# EAGLE design led_analog_clock_v1 (EAGLE 5.07)
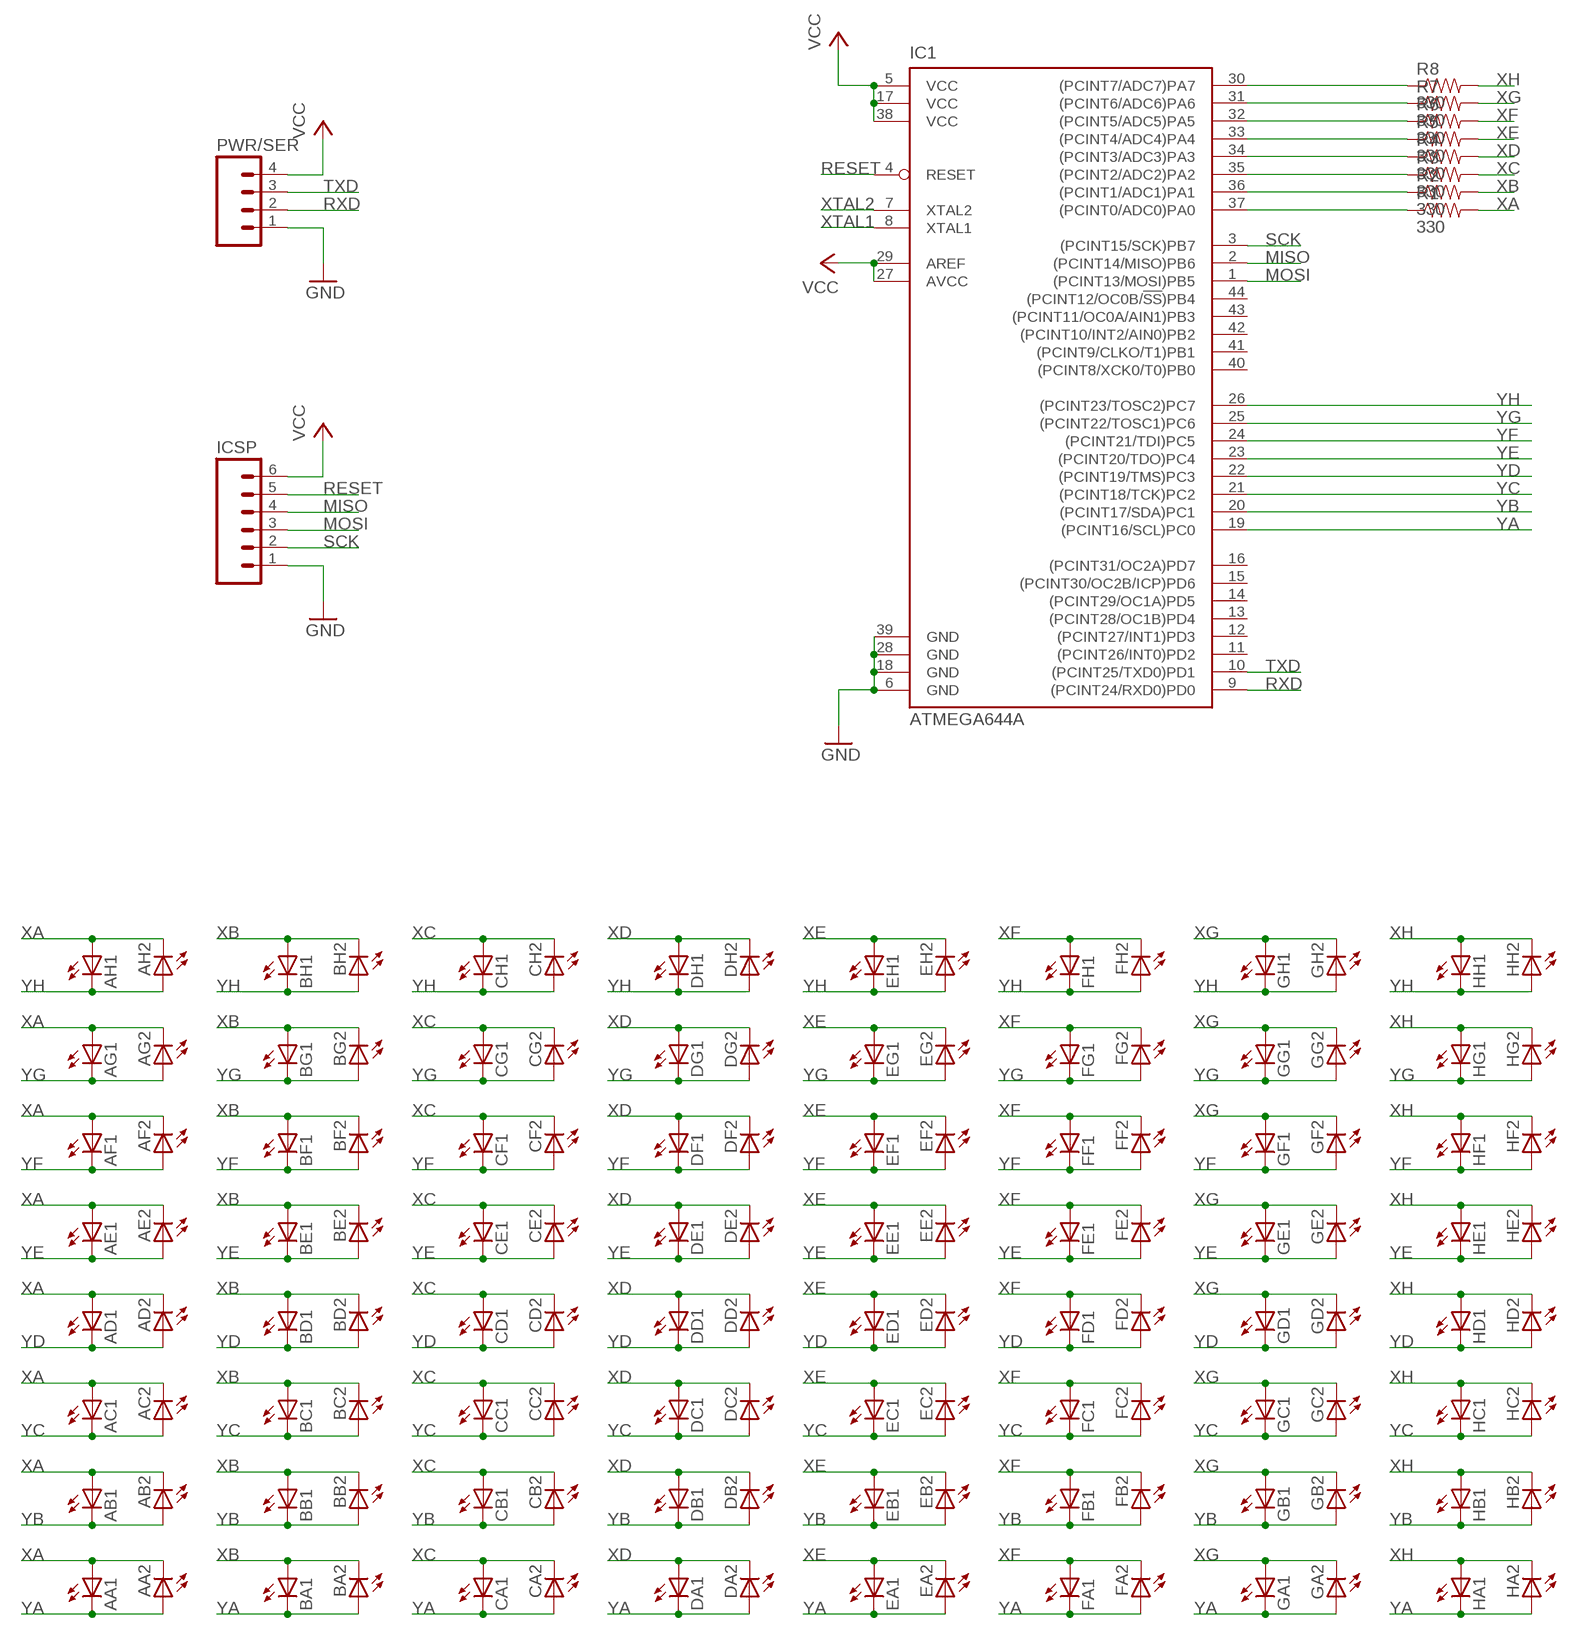
[diagram p0: schematic, sheet 1]

## Parts
AA1  LED0603  [LED-0603]
AA2  LED0603  [LED-0603]
AB1  LED0603  [LED-0603]
AB2  LED0603  [LED-0603]
AC1  LED0603  [LED-0603]
AC2  LED0603  [LED-0603]
AD1  LED0603  [LED-0603]
AD2  LED0603  [LED-0603]
AE1  LED0603  [LED-0603]
AE2  LED0603  [LED-0603]
AF1  LED0603  [LED-0603]
AF2  LED0603  [LED-0603]
AG1  LED0603  [LED-0603]
AG2  LED0603  [LED-0603]
AH1  LED0603  [LED-0603]
AH2  LED0603  [LED-0603]
BA1  LED0603  [LED-0603]
BA2  LED0603  [LED-0603]
BB1  LED0603  [LED-0603]
BB2  LED0603  [LED-0603]
BC1  LED0603  [LED-0603]
BC2  LED0603  [LED-0603]
BD1  LED0603  [LED-0603]
BD2  LED0603  [LED-0603]
BE1  LED0603  [LED-0603]
BE2  LED0603  [LED-0603]
BF1  LED0603  [LED-0603]
BF2  LED0603  [LED-0603]
BG1  LED0603  [LED-0603]
BG2  LED0603  [LED-0603]
BH1  LED0603  [LED-0603]
BH2  LED0603  [LED-0603]
CA1  LED0603  [LED-0603]
CA2  LED0603  [LED-0603]
CB1  LED0603  [LED-0603]
CB2  LED0603  [LED-0603]
CC1  LED0603  [LED-0603]
CC2  LED0603  [LED-0603]
CD1  LED0603  [LED-0603]
CD2  LED0603  [LED-0603]
CE1  LED0603  [LED-0603]
CE2  LED0603  [LED-0603]
CF1  LED0603  [LED-0603]
CF2  LED0603  [LED-0603]
CG1  LED0603  [LED-0603]
CG2  LED0603  [LED-0603]
CH1  LED0603  [LED-0603]
CH2  LED0603  [LED-0603]
DA1  LED0603  [LED-0603]
DA2  LED0603  [LED-0603]
DB1  LED0603  [LED-0603]
DB2  LED0603  [LED-0603]
DC1  LED0603  [LED-0603]
DC2  LED0603  [LED-0603]
DD1  LED0603  [LED-0603]
DD2  LED0603  [LED-0603]
DE1  LED0603  [LED-0603]
DE2  LED0603  [LED-0603]
DF1  LED0603  [LED-0603]
DF2  LED0603  [LED-0603]
DG1  LED0603  [LED-0603]
DG2  LED0603  [LED-0603]
DH1  LED0603  [LED-0603]
DH2  LED0603  [LED-0603]
EA1  LED0603  [LED-0603]
EA2  LED0603  [LED-0603]
EB1  LED0603  [LED-0603]
EB2  LED0603  [LED-0603]
EC1  LED0603  [LED-0603]
EC2  LED0603  [LED-0603]
ED1  LED0603  [LED-0603]
ED2  LED0603  [LED-0603]
EE1  LED0603  [LED-0603]
EE2  LED0603  [LED-0603]
EF1  LED0603  [LED-0603]
EF2  LED0603  [LED-0603]
EG1  LED0603  [LED-0603]
EG2  LED0603  [LED-0603]
EH1  LED0603  [LED-0603]
EH2  LED0603  [LED-0603]
FA1  LED0603  [LED-0603]
FA2  LED0603  [LED-0603]
FB1  LED0603  [LED-0603]
FB2  LED0603  [LED-0603]
FC1  LED0603  [LED-0603]
FC2  LED0603  [LED-0603]
FD1  LED0603  [LED-0603]
FD2  LED0603  [LED-0603]
FE1  LED0603  [LED-0603]
FE2  LED0603  [LED-0603]
FF1  LED0603  [LED-0603]
FF2  LED0603  [LED-0603]
FG1  LED0603  [LED-0603]
FG2  LED0603  [LED-0603]
FH1  LED0603  [LED-0603]
FH2  LED0603  [LED-0603]
GA1  LED0603  [LED-0603]
GA2  LED0603  [LED-0603]
GB1  LED0603  [LED-0603]
GB2  LED0603  [LED-0603]
GC1  LED0603  [LED-0603]
GC2  LED0603  [LED-0603]
GD1  LED0603  [LED-0603]
GD2  LED0603  [LED-0603]
GE1  LED0603  [LED-0603]
GE2  LED0603  [LED-0603]
GF1  LED0603  [LED-0603]
GF2  LED0603  [LED-0603]
GG1  LED0603  [LED-0603]
GG2  LED0603  [LED-0603]
GH1  LED0603  [LED-0603]
GH2  LED0603  [LED-0603]
HA1  LED0603  [LED-0603]
HA2  LED0603  [LED-0603]
HB1  LED0603  [LED-0603]
HB2  LED0603  [LED-0603]
HC1  LED0603  [LED-0603]
HC2  LED0603  [LED-0603]
HD1  LED0603  [LED-0603]
HD2  LED0603  [LED-0603]
HE1  LED0603  [LED-0603]
HE2  LED0603  [LED-0603]
HF1  LED0603  [LED-0603]
HF2  LED0603  [LED-0603]
HG1  LED0603  [LED-0603]
HG2  LED0603  [LED-0603]
HH1  LED0603  [LED-0603]
HH2  LED0603  [LED-0603]
IC1  ATMEGA644A  [TQFP44]
ICSP  M06SIP  [1X06]
PWR/SER  M04PTH  [1X04]
R1  330  RESISTOR0603-RES  [0603-RES]
R2  330  RESISTOR0603-RES  [0603-RES]
R3  330  RESISTOR0603-RES  [0603-RES]
R4  330  RESISTOR0603-RES  [0603-RES]
R5  330  RESISTOR0603-RES  [0603-RES]
R6  330  RESISTOR0603-RES  [0603-RES]
R7  330  RESISTOR0603-RES  [0603-RES]
R8  330  RESISTOR0603-RES  [0603-RES]

## Nets
GND [supply]: IC1.6(GND) IC1.18(GND) IC1.28(GND) IC1.39(GND) ICSP.1 PWR/SER.1
MISO: IC1.2((PCINT14/MISO)PB6) ICSP.4
MOSI: IC1.1((PCINT13/MOSI)PB5) ICSP.3
N$1: IC1.30((PCINT7/ADC7)PA7) R8.1
N$2: IC1.31((PCINT6/ADC6)PA6) R7.1
N$3: IC1.32((PCINT5/ADC5)PA5) R6.1
N$4: IC1.33((PCINT4/ADC4)PA4) R5.1
N$5: IC1.34((PCINT3/ADC3)PA3) R4.1
N$6: IC1.35((PCINT2/ADC2)PA2) R3.1
N$7: IC1.36((PCINT1/ADC1)PA1) R2.1
N$8: IC1.37((PCINT0/ADC0)PA0) R1.1
RESET: IC1.4(RESET) ICSP.5
RXD: IC1.9((PCINT24/RXD0)PD0) PWR/SER.2
SCK: IC1.3((PCINT15/SCK)PB7) ICSP.2
TXD: IC1.10((PCINT25/TXD0)PD1) PWR/SER.3
VCC [supply]: IC1.5(VCC) IC1.17(VCC) IC1.27(AVCC) IC1.29(AREF) IC1.38(VCC) ICSP.6 PWR/SER.4
XA: AA1.A AA2.C AB1.A AB2.C AC1.A AC2.C AD1.A AD2.C AE1.A AE2.C AF1.A AF2.C AG1.A AG2.C AH1.A AH2.C R1.2
XB: BA1.A BA2.C BB1.A BB2.C BC1.A BC2.C BD1.A BD2.C BE1.A BE2.C BF1.A BF2.C BG1.A BG2.C BH1.A BH2.C R2.2
XC: CA1.A CA2.C CB1.A CB2.C CC1.A CC2.C CD1.A CD2.C CE1.A CE2.C CF1.A CF2.C CG1.A CG2.C CH1.A CH2.C R3.2
XD: DA1.A DA2.C DB1.A DB2.C DC1.A DC2.C DD1.A DD2.C DE1.A DE2.C DF1.A DF2.C DG1.A DG2.C DH1.A DH2.C R4.2
XE: EA1.A EA2.C EB1.A EB2.C EC1.A EC2.C ED1.A ED2.C EE1.A EE2.C EF1.A EF2.C EG1.A EG2.C EH1.A EH2.C R5.2
XF: FA1.A FA2.C FB1.A FB2.C FC1.A FC2.C FD1.A FD2.C FE1.A FE2.C FF1.A FF2.C FG1.A FG2.C FH1.A FH2.C R6.2
XG: GA1.A GA2.C GB1.A GB2.C GC1.A GC2.C GD1.A GD2.C GE1.A GE2.C GF1.A GF2.C GG1.A GG2.C GH1.A GH2.C R7.2
XH: HA1.A HA2.C HB1.A HB2.C HC1.A HC2.C HD1.A HD2.C HE1.A HE2.C HF1.A HF2.C HG1.A HG2.C HH1.A HH2.C R8.2
XTAL1: IC1.8(XTAL1)
XTAL2: IC1.7(XTAL2)
YA: AA1.C AA2.A BA1.C BA2.A CA1.C CA2.A DA1.C DA2.A EA1.C EA2.A FA1.C FA2.A GA1.C GA2.A HA1.C HA2.A IC1.19((PCINT16/SCL)PC0)
YB: AB1.C AB2.A BB1.C BB2.A CB1.C CB2.A DB1.C DB2.A EB1.C EB2.A FB1.C FB2.A GB1.C GB2.A HB1.C HB2.A IC1.20((PCINT17/SDA)PC1)
YC: AC1.C AC2.A BC1.C BC2.A CC1.C CC2.A DC1.C DC2.A EC1.C EC2.A FC1.C FC2.A GC1.C GC2.A HC1.C HC2.A IC1.21((PCINT18/TCK)PC2)
YD: AD1.C AD2.A BD1.C BD2.A CD1.C CD2.A DD1.C DD2.A ED1.C ED2.A FD1.C FD2.A GD1.C GD2.A HD1.C HD2.A IC1.22((PCINT19/TMS)PC3)
YE: AE1.C AE2.A BE1.C BE2.A CE1.C CE2.A DE1.C DE2.A EE1.C EE2.A FE1.C FE2.A GE1.C GE2.A HE1.C HE2.A IC1.23((PCINT20/TDO)PC4)
YF: AF1.C AF2.A BF1.C BF2.A CF1.C CF2.A DF1.C DF2.A EF1.C EF2.A FF1.C FF2.A GF1.C GF2.A HF1.C HF2.A IC1.24((PCINT21/TDI)PC5)
YG: AG1.C AG2.A BG1.C BG2.A CG1.C CG2.A DG1.C DG2.A EG1.C EG2.A FG1.C FG2.A GG1.C GG2.A HG1.C HG2.A IC1.25((PCINT22/TOSC1)PC6)
YH: AH1.C AH2.A BH1.C BH2.A CH1.C CH2.A DH1.C DH2.A EH1.C EH2.A FH1.C FH2.A GH1.C GH2.A HH1.C HH2.A IC1.26((PCINT23/TOSC2)PC7)
Unconnected: IC1.11((PCINT26/INT0)PD2) IC1.12((PCINT27/INT1)PD3) IC1.13((PCINT28/OC1B)PD4) IC1.14((PCINT29/OC1A)PD5) IC1.15((PCINT30/OC2B/ICP)PD6) IC1.16((PCINT31/OC2A)PD7) IC1.40((PCINT8/XCK0/T0)PB0) IC1.41((PCINT9/CLKO/T1)PB1) IC1.42((PCINT10/INT2/AIN0)PB2) IC1.43((PCINT11/OC0A/AIN1)PB3) IC1.44((PCINT12/OC0B/!SS!)PB4)

## Library data of the parts
AA1 AA2 AB1 AB2 AC1 AC2 AD1 AD2 AE1 AE2 AF1 AF2 AG1 AG2 AH1 AH2 BA1 BA2 BB1 BB2 BC1 BC2 BD1 BD2 BE1 BE2 BF1 BF2 BG1 BG2 BH1 BH2 CA1 CA2 CB1 CB2 CC1 CC2 CD1 CD2 CE1 CE2 CF1 CF2 CG1 CG2 CH1 CH2 DA1 DA2 DB1 DB2 DC1 DC2 DD1 DD2 DE1 DE2 DF1 DF2 DG1 DG2 DH1 DH2 EA1 EA2 EB1 EB2 EC1 EC2 ED1 ED2 EE1 EE2 EF1 EF2 EG1 EG2 EH1 EH2 FA1 FA2 FB1 FB2 FC1 FC2 FD1 FD2 FE1 FE2 FF1 FF2 FG1 FG2 FH1 FH2 GA1 GA2 GB1 GB2 GC1 GC2 GD1 GD2 GE1 GE2 GF1 GF2 GG1 GG2 GH1 GH2 HA1 HA2 HB1 HB2 HC1 HC2 HD1 HD2 HE1 HE2 HF1 HF2 HG1 HG2 HH1 HH2 = SparkFun:LED: LEDs Standard schematic elements and footprints for 5mm, 3mm, 1206, and 0603 sized LEDs. 5mm - Spark Fun Electronics SKU : COM-00529 (and others)
IC1 = atmel:ATMEGA644: 8-bit Microcontroller with 64K Bytes In-System Programmable Flash Source: http://www.atmel.com/dyn/resources/prod_documents/doc2593.pdf
ICSP = SparkFun:M06: Header 6 Standard 6-pin 0.1" header. Use with straight break away headers (SKU : PRT-00116), right angle break away headers (PRT-00553), swiss pins (PRT-00743), machine pins (PRT-00117), and female headers (PRT-00115). Molex polarized connector foot print use with SKU : PRT-08094 with associated crimp pins and housings. NOTES ON THE VARIANTS LOCK and LOCK_LONGPADS... This footprint was designed to help hold the alignment of a through-hole component (i.e. 6-pin header) while soldering it into place. You may notice that each hole has been shifted either up or down by 0.005 of an inch from it's more standard position (which is a perfectly straight line). This slight alteration caused the pins (the squares in the middle) to touch the edges of the holes. Because they are alternating, it causes a "brace" to hold the component in place. 0.005 has proven to be the perfect amount of "off-center" position when using our standard breakaway headers. Although looks a little odd when you look at the bare footprint, once you have a header in there, the alteration is very hard to notice. Also, if you push a header all the way into place, it is covered up entirely on the bottom side. This idea of altering the position of holes to aid alignment will be further integrated into the Sparkfun Library for other footprints. It can help hold any component with 3 or more connection pins.
PWR/SER = SparkFun:M04: Header 4 Standard 4-pin 0.1" header. Use with straight break away headers (SKU : PRT-00116), right angle break away headers (PRT-00553), swiss pins (PRT-00743), machine pins (PRT-00117), and female headers (PRT-00115). Molex polarized connector foot print use with SKU : PRT-08231 with associated crimp pins and housings.
R1-R8 = SparkFun:RESISTOR: Resistor Basic schematic elements and footprints for 0603, 1206, and PTH 1/10th watt (small) resistors.

## Net classes
0 signal: width 0.203 mm
1 supply: width 0.305 mm

## Board
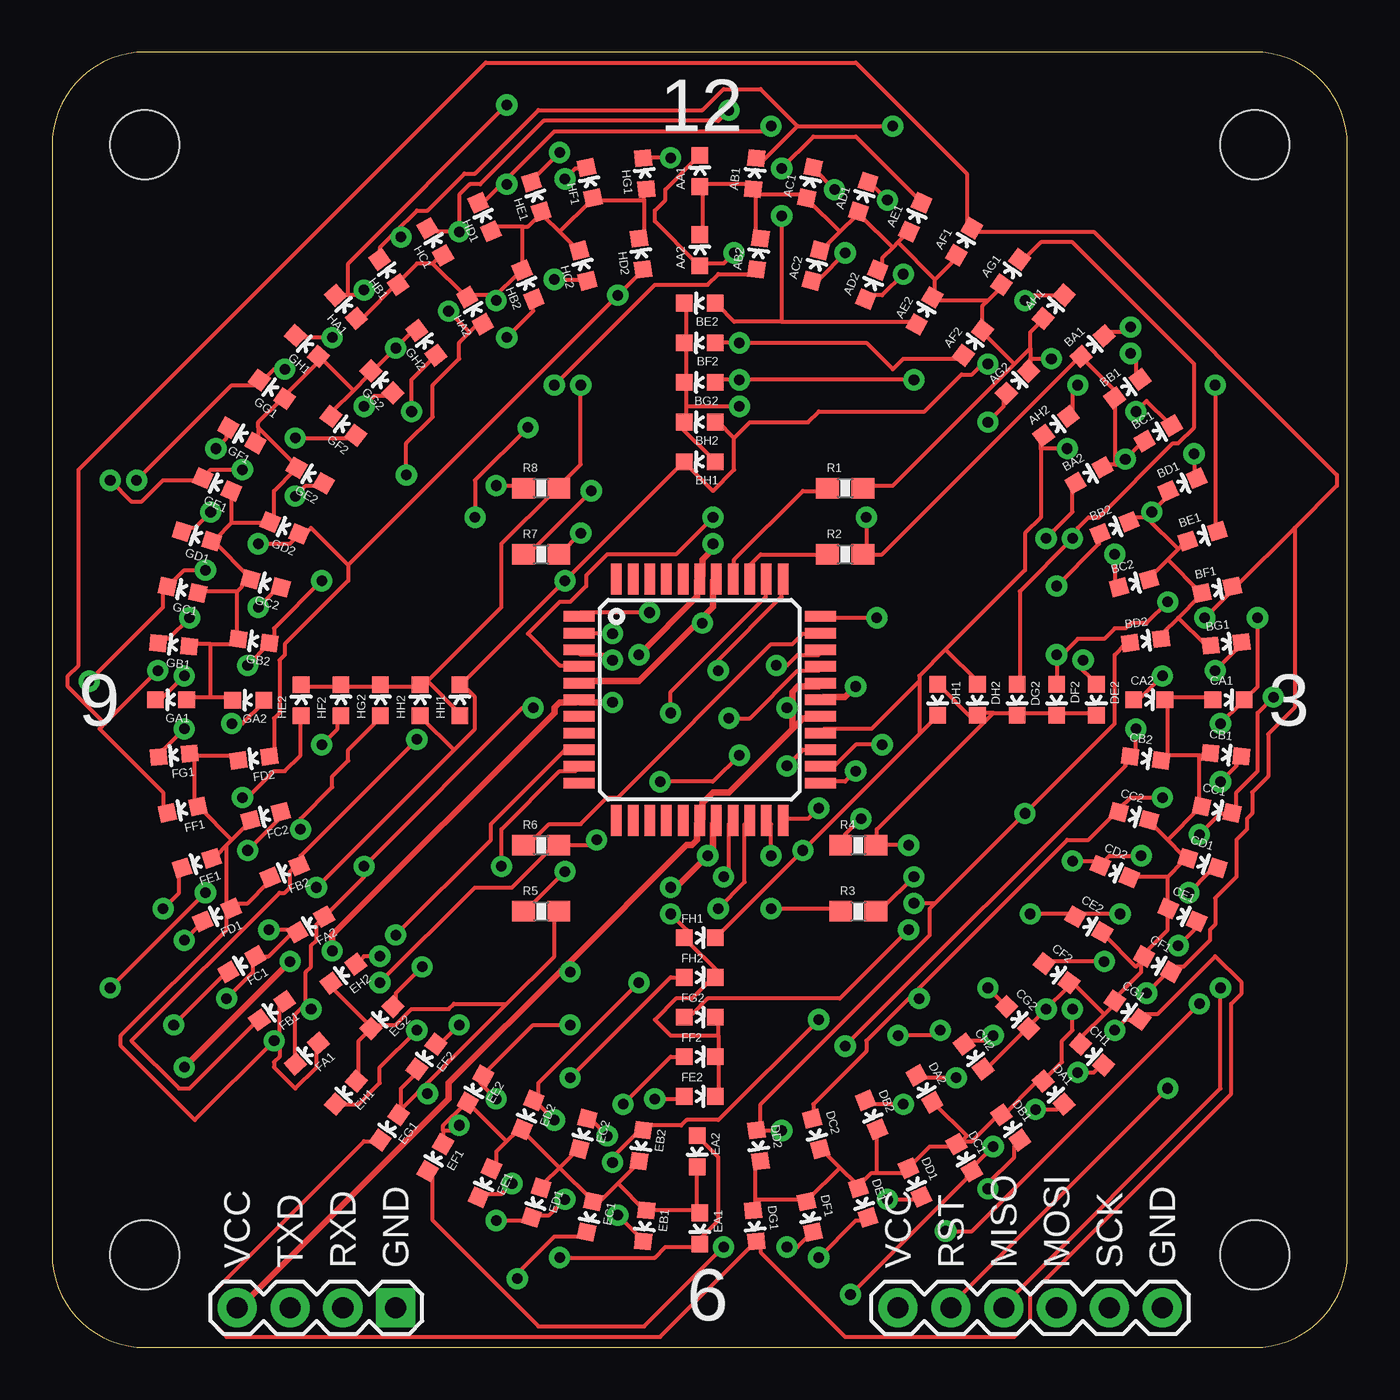
[diagram p1: board, top side]
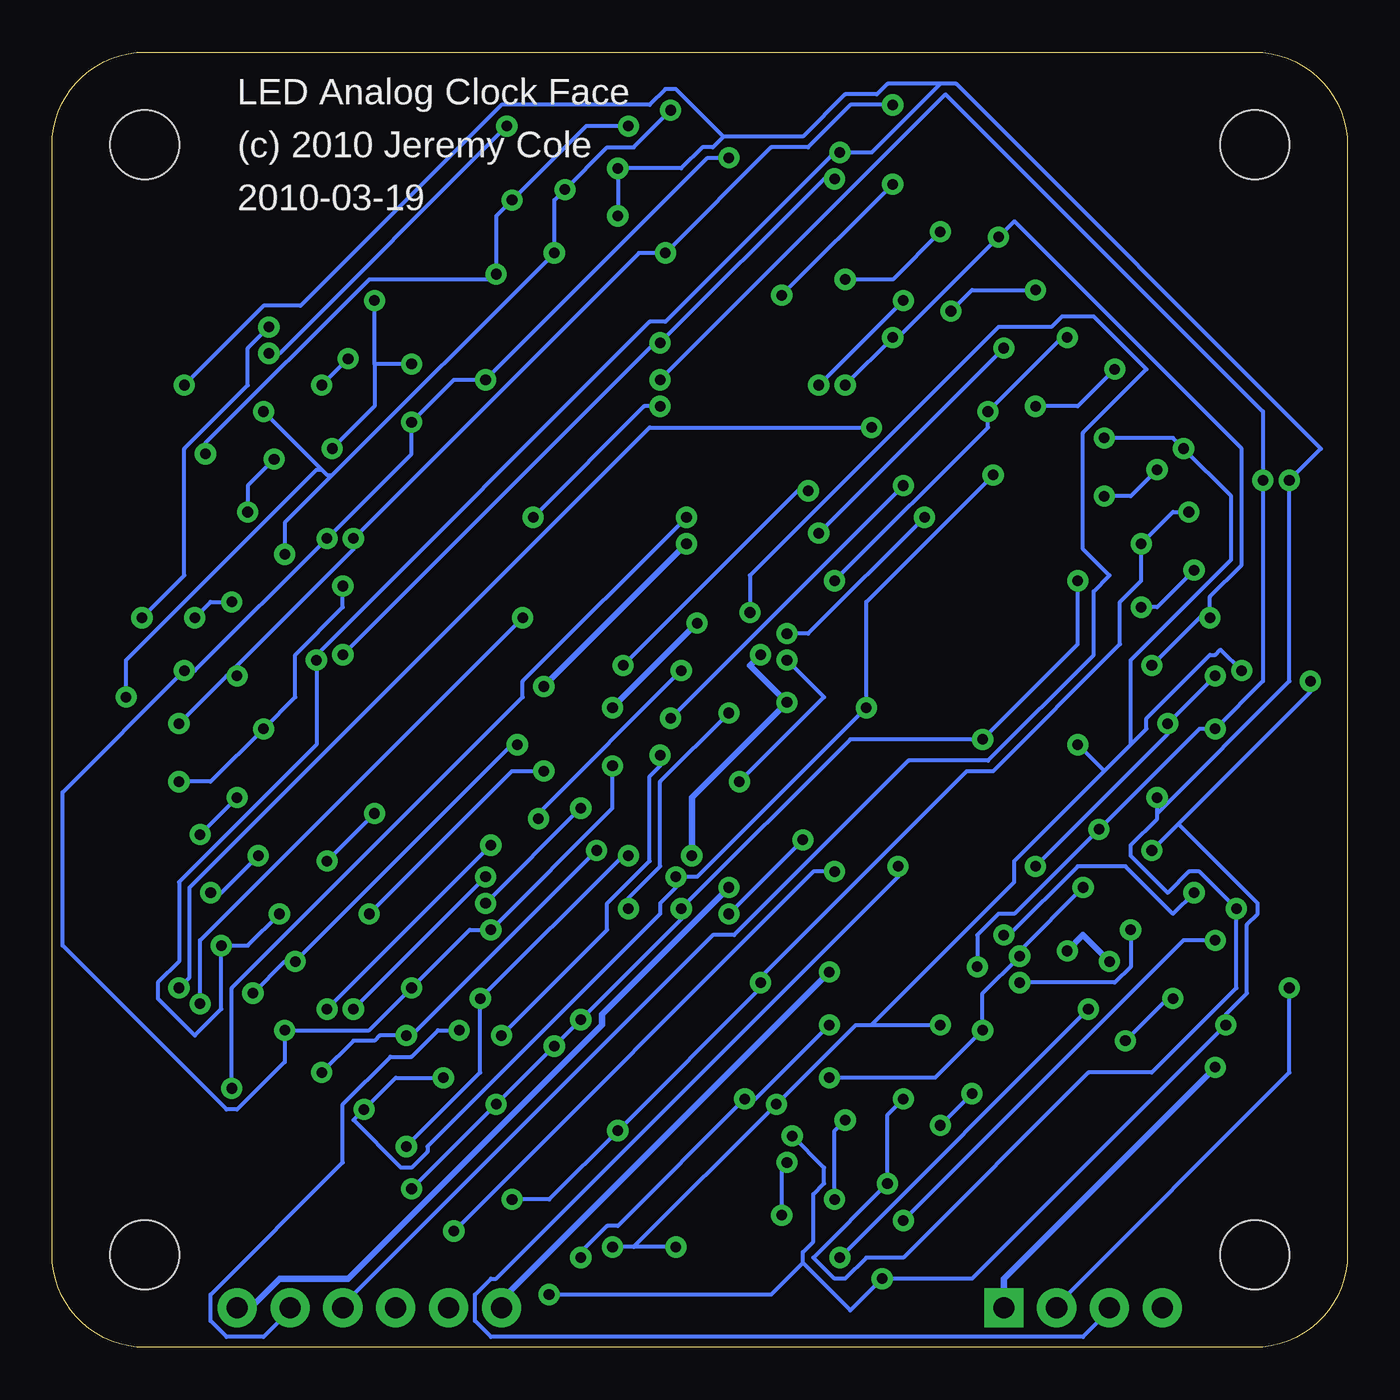
[diagram p2: board, bottom side, seen from below]

Size 62.23 x 62.23 mm. Coordinates in mm from the lower left corner, seen from the top.
Outline: 0,4.49 arc90 4.49,0 57.74,0 arc90 62.23,4.49 62.23,57.74 arc90 57.74,62.23 4.49,62.23 arc90 0,57.74 0,4.49
Copper layers (1*16): Top 0.035mm / dielectric 1.5mm / Bottom 0.035mm
Design rules "SparkFun": minimum track width 8mil, minimum drill 20mil, track to track 8mil, track to pad 8mil, pad to pad 8mil, via to via 8mil, smd to smd 8mil, copper to edge 10mil, drill to drill 8mil, minimum pad ring 12mil, minimum via ring 10mil, stop-mask expansion 4mil, vias tented up to drill 25mil, thermal gap 10mil

### Footprints (pad centres in the part's own frame; a part is rotated, then mirrored left to right if it is on the bottom)
LED-0603 = smd 0.8 x 0.8: A 0,-0.75; C 0,0.75
TQFP44 = smd 1.5 x 0.5: 1 -5.8,4; 2 -5.8,3.2; 3 -5.8,2.4; 4 -5.8,1.6; 5 -5.8,0.8; 6 -5.8,0; 7 -5.8,-0.8; 8 -5.8,-1.6; 9 -5.8,-2.4; 10 -5.8,-3.2; 11 -5.8,-4; 23 5.8,-4; 24 5.8,-3.2; 25 5.8,-2.4; 26 5.8,-1.6; 27 5.8,-0.8; 28 5.8,0; 29 5.8,0.8; 30 5.8,1.6; 31 5.8,2.4; 32 5.8,3.2; 33 5.8,4 | smd 0.5 x 1.5: 12 -4,-5.8; 13 -3.2,-5.8; 14 -2.4,-5.8; 15 -1.6,-5.8; 16 -0.8,-5.8; 17 0,-5.8; 18 0.8,-5.8; 19 1.6,-5.8; 20 2.4,-5.8; 21 3.2,-5.8; 22 4,-5.8; 34 4,5.8; 35 3.2,5.8; 36 2.4,5.8; 37 1.6,5.8; 38 0.8,5.8; 39 0,5.8; 40 -0.8,5.8; 41 -1.6,5.8; 42 -2.4,5.8; 43 -3.2,5.8; 44 -4,5.8
1X06 = drill 1.016 pad 1.88 round: 1 0,0; 2 2.54,0; 3 5.08,0; 4 7.62,0; 5 10.16,0; 6 12.7,0
1X04 = drill 1.016 pad 1.88 square: 1 0,0 | drill 1.016 pad 1.88 round: 2 2.54,0; 3 5.08,0; 4 7.62,0
0603-RES = smd 1.1 x 1: 1 -0.85,0; 2 0.85,0
STAND-OFF = hole 3.302: 0,0

### Placement (x,y rotation side)
AA1  31.11,56.52 0 top
AA2  31.11,52.7 0 top
AB1  33.76,56.39 354 top
AB2  33.93,52.53 352.5 top
AC1  36.41,55.95 348 top
AC2  36.7,51.97 345 top
AD1  38.97,55.27 342 top
AD2  39.38,51.05 337.5 top
AE1  41.47,54.3 336 top
AE2  41.92,49.8 330 top
AF1  43.81,53.12 330 top
AF2  44.24,48.26 322.5 top
AG1  46.04,51.66 324 top
AG2  46.38,46.37 315 top
AH1  48.12,49.99 318 top
AH2  48.23,44.27 307.5 top
BA1  49.99,48.1 312 top
BA2  49.82,41.9 300 top
BB1  51.66,46.06 306 top
BB2  51.04,39.38 292.5 top
BC1  53.14,43.91 300 top
BC2  51.98,36.71 285 top
BD1  54.3,41.45 294 top
BD2  52.53,33.94 277.5 top
BE1  55.27,38.98 288 top
BE2  31.11,50.16 90 top
BF1  55.96,36.4 282 top
BF2  31.11,48.26 90 top
BG1  56.4,33.8 276 top
BG2  31.11,46.35 90 top
BH1  31.11,42.55 90 top
BH2  31.11,44.45 90 top
CA1  56.52,31.11 270 top
CA2  52.7,31.11 270 top
CB1  56.39,28.47 264 top
CB2  52.53,28.3 262.5 top
CC1  55.96,25.83 258 top
CC2  51.97,25.53 255 top
CD1  55.27,23.27 252 top
CD2  51.05,22.86 247.5 top
CE1  54.31,20.78 246 top
CE2  49.81,20.32 240 top
CF1  53.11,18.41 240 top
CF2  48.26,17.98 232.5 top
CG1  51.66,16.21 234 top
CG2  46.38,15.85 225 top
CH1  49.96,14.07 228 top
CH2  44.27,13.97 217.5 top
DA1  48.11,12.24 222 top
DA2  41.91,12.42 210 top
DB1  46.05,10.57 216 top
DB2  39.37,11.18 202.5 top
DC1  43.81,9.12 210 top
DC2  36.7,10.26 195 top
DD1  41.45,7.92 204 top
DD2  33.93,9.7 187.5 top
DE1  38.96,6.96 198 top
DE2  50.16,31.11 180 top
DF1  36.4,6.27 192 top
DF2  48.26,31.11 180 top
DG1  33.76,5.84 186 top
DG2  46.35,31.11 180 top
DH1  42.55,31.11 180 top
DH2  44.45,31.11 180 top
EA1  31.11,5.71 180 top
EA2  30.99,9.42 180 top
EB1  28.47,5.84 174 top
EB2  28.3,9.7 172.5 top
EC1  25.83,6.27 168 top
EC2  25.53,10.26 165 top
ED1  23.27,6.96 162 top
ED2  22.86,11.18 157.5 top
EE1  20.8,7.9 156 top
EE2  20.35,12.4 150 top
EF1  18.41,9.12 150 top
EF2  17.98,13.97 142.5 top
EG1  16.21,10.57 144 top
EG2  15.85,15.85 135 top
EH1  14.12,12.24 138 top
EH2  14,17.96 127.5 top
FA1  12.24,14.12 132 top
FA2  12.42,20.32 120 top
FB1  10.57,16.18 126 top
FB2  11.18,22.86 112.5 top
FC1  9.12,18.41 120 top
FC2  10.26,25.53 105 top
FD1  7.92,20.78 114 top
FD2  9.7,28.3 97.5 top
FE1  6.96,23.27 108 top
FE2  31.11,12.06 270 top
FF1  6.27,25.83 102 top
FF2  31.11,13.97 270 top
FG1  5.87,28.45 96 top
FG2  31.11,15.88 270 top
FH1  31.11,19.68 270 top
FH2  31.11,17.78 270 top
GA1  5.71,31.11 90 top
GA2  9.42,31.09 90 top
GB1  5.84,33.76 84 top
GB2  9.7,33.93 82.5 top
GC1  6.27,36.4 78 top
GC2  10.26,36.7 75 top
GD1  6.96,38.96 72 top
GD2  11.18,39.37 67.5 top
GE1  7.92,41.45 66 top
GE2  12.4,41.88 60 top
GF1  9.12,43.81 60 top
GF2  14,44.27 52.5 top
GG1  10.57,46.02 54 top
GG2  15.85,46.38 45 top
GH1  12.24,48.11 48 top
GH2  17.98,48.26 37.5 top
HA1  14.12,49.99 42 top
HA2  20.32,49.81 30 top
HB1  16.18,51.66 36 top
HB2  22.86,51.05 22.5 top
HC1  18.41,53.11 30 top
HC2  25.53,51.97 15 top
HD1  20.78,54.31 24 top
HD2  28.3,52.53 7.5 top
HE1  23.27,55.27 18 top
HE2  11.96,31.09 0 top
HF1  25.83,55.96 12 top
HF2  13.87,31.09 0 top
HG1  28.47,56.39 6 top
HG2  15.77,31.09 0 top
HH1  19.58,31.09 0 top
HH2  17.68,31.09 0 top
IC1  31.11,31.11 0 top
ICSP  53.34,1.91 180 top
PWR/SER  16.51,1.91 180 top
R1  38.1,41.27 0 top
R2  38.1,38.1 0 top
R3  38.73,20.95 0 top
R4  38.73,24.13 0 top
R5  23.5,20.95 0 top
R6  23.5,24.13 0 top
R7  23.5,38.1 0 top
R8  23.5,41.27 0 top
U$1  [STAND-OFF]  57.78,57.78 0 top
U$2  [STAND-OFF]  4.45,57.78 0 top
U$3  [STAND-OFF]  4.45,4.45 0 top
U$4  [STAND-OFF]  57.78,4.45 0 top

### Tracks (layer width: path | path; a pad name or v marks a point on that pad's centre or on a via)
GND  (via drill 0.51)
  Top 0.305: v26.92,30.99 25.4,30.99 IC1.6 25.15,30.99 24.38,30.99 24.13,30.73 24.13,30.48 13.46,19.81 v13.46,19.05 | v28.19,33.27 30.99,36.07 30.99,36.83 IC1.39 31.24,37.08 31.24,37.85 31.75,38.35 v31.75,38.61 | IC1.18 31.75,25.15 31.75,23.88 v31.5,23.62 29.97,22.1 v29.72,22.1 | v38.61,31.75 38.1,31.24 37.08,31.24 IC1.28 | v6.35,13.46 v11.43,18.54
  Bottom 0.305: v28.19,33.27 28.7,32.77 v26.92,30.99 31.5,26.42 v31.5,23.62 | v31.75,38.61 v38.61,31.75 | v6.35,13.46 16.51,3.3 PWR/SER.1 | v11.43,18.54 12.7,19.81 v13.46,19.05 | v29.72,22.1 35.81,16 35.81,15.49 48.01,3.3 51.31,3.3 52.58,2.03 53.34,2.03 ICSP.1
MISO  (via drill 0.51)
  Top 0.203: v26.92,34.29 25.4,34.29 IC1.2 | v20.32,39.88 20.32,41.66 v22.86,44.2 | v56.13,17.27 56.13,12.45 45.72,2.03 ICSP.4
  Bottom 0.203: v26.92,34.29 25.91,34.29 v20.32,39.88 | v22.86,44.2 33.53,44.2 55.63,22.1 55.63,17.78 v56.13,17.27
MOSI  (via drill 0.51)
  Top 0.203: v28.7,35.31 25.4,35.31 IC1.1
  Bottom 0.203: v28.7,35.31 28.7,37.08 16.76,49.02 14.22,49.02 13.72,49.53 12.19,49.53 9.65,46.99 12.7,43.94 12.7,38.35 11.43,37.08 12.19,36.32 12.19,33.27 17.27,28.19 21.08,28.19 29.46,19.81 30.48,19.81 48.26,2.03 ICSP.3
N$1  (via drill 0.51)
  Top 0.203: v21.34,41.4 22.61,41.4 R8.1 | v32.51,30.23 33.53,30.23 35.81,32.51 36.83,32.51 IC1.30
  Bottom 0.203: v32.51,30.23 v21.34,41.4
N$2  (via drill 0.51)
  Top 0.203: v25.91,41.15 22.86,38.1 R7.1 | v34.8,32.77 35.31,32.77 35.81,33.27 36.83,33.27 IC1.31
  Bottom 0.203: v25.91,41.15 26.42,41.15 v34.8,32.77
N$3
  Top 0.203: R6.1 22.86,24.13 23.88,25.15 25.4,25.15 26.67,26.42 27.18,26.42 34.54,33.78 35.56,33.78 36.07,34.29 36.83,34.29 IC1.32
N$4  (via drill 0.51)
  Top 0.203: v24.64,22.86 22.86,21.08 R5.1 | v42.93,5.59 44.2,5.59 v55.12,16.51 | v39.62,35.05 37.08,35.05 IC1.33
  Bottom 0.203: v24.64,22.86 25.65,22.86 v42.93,5.59 | v55.12,16.51 55.12,19.56 v39.62,35.05
N$5  (via drill 0.51)
  Top 0.203: v38.86,25.4 38.1,24.64 38.1,24.13 R4.1 | v32,32.51 32,33.02 35.05,36.07 35.05,36.83 IC1.34
  Bottom 0.203: v38.86,25.4 38.86,25.65 v32,32.51
N$6  (via drill 0.51)
  Top 0.203: v34.54,21.08 37.85,21.08 R3.1 | v29.72,30.48 29.72,31.5 34.29,36.07 34.29,36.83 IC1.35
  Bottom 0.203: v34.54,21.08 34.54,21.59 33.02,23.11 33.02,27.18 v29.72,30.48
N$7
  Top 0.203: R2.1 34.04,38.1 33.53,37.59 33.53,37.08 IC1.36
N$8
  Top 0.203: R1.1 37.08,41.15 36.07,41.15 32.77,37.85 32.77,37.08 IC1.37
RESET  (via drill 0.51)
  Top 0.203: v31.75,39.88 29.97,38.1 26.67,38.1 25.65,37.08 25.65,36.58 24.89,35.81 24.38,35.81 22.86,34.29 24.38,32.77 25.15,32.77 IC1.4 | v53.59,12.45 43.18,2.03 ICSP.5
  Bottom 0.203: v31.75,39.88 39.62,32 39.62,31.24 53.59,17.27 v53.59,12.45
RXD  (via drill 0.51)
  Top 0.203: v16.51,19.81 21.08,24.38 21.08,25.15 24.64,28.7 25.15,28.7 IC1.9 | v2.79,17.27 v7.37,21.84
  Bottom 0.203: v16.51,19.81 16.26,19.81 12.95,23.11 10.67,23.11 8.38,20.83 v7.37,21.84 | v2.79,17.27 2.79,13.21 13.97,2.03 PWR/SER.2
SCK  (via drill 0.51)
  Top 0.203: v26.92,33.02 26.67,33.27 25.4,33.27 IC1.3 | v29.21,27.18 31.75,27.18 v33.02,28.45 | v40.64,14.99 42.42,14.99 v42.67,15.24
  Bottom 0.203: v26.92,33.02 25.15,31.24 v29.21,27.18 | v33.02,28.45 33.02,27.94 33.53,27.43 33.53,23.37 35.56,21.34 35.56,20.07 v40.64,14.99 | v42.67,15.24 43.69,15.24 44.96,13.97 45.97,13.97 48.26,11.68 48.26,8.89 54.61,2.54 54.61,1.27 53.85,0.51 52.07,0.51 50.8,1.78 ICSP.2
TXD  (via drill 0.51)
  Top 0.203: v21.59,23.11 21.59,24.89 24.38,27.69 25.15,27.69 IC1.10
  Bottom 0.203: v21.59,23.11 21.59,22.61 40.89,3.3 41.15,3.3 41.91,2.54 41.91,1.27 41.15,0.51 12.7,0.51 11.43,1.78 PWR/SER.3
VCC  (via drill 0.51)
  Top 0.305: 30.99,34.8 31.75,35.56 31.75,36.83 IC1.38 | 30.99,34.8 28.19,32 25.4,32 IC1.5 | 35.56,29.72 36.07,30.23 36.83,30.23 IC1.27 | 35.56,29.72 32.51,26.67 31.75,26.67 31.24,26.16 31.24,25.4 IC1.17 30.99,25.15 30.99,24.38 30.73,24.13 30.48,24.13 24.64,18.29 | 35.56,29.72 35.56,30.73 | 35.56,30.73 35.56,31.5 35.81,31.75 36.83,31.75 IC1.29 | 24.64,18.29 19.05,12.7 19.05,11.94 9.14,2.03 8.89,2.03 PWR/SER.4 | 24.64,18.29 v24.89,18.03 | v31.24,34.8 30.99,34.8 | 35.56,30.73 v35.31,30.73
  Bottom 0.305: v24.89,18.03 40.64,2.29 ICSP.6 | v35.31,30.73 v31.24,34.8
XA  (via drill 0.51)
  Top 0.203: AA2.C 31.24,53.59 31.24,55.63 AA1.A 31.24,55.88 33.53,55.88 AB1.A | 33.78,55.37 33.78,53.34 AB2.C | 33.78,55.37 33.78,55.63 AB1.A | 40.64,53.09 41.15,53.59 AE1.A | 40.64,53.09 40.39,52.83 | 40.39,52.83 39.88,52.32 39.88,51.82 AD2.C | 37.85,53.59 38.61,54.36 AD1.A 38.86,54.36 40.39,52.83 | 37.85,53.59 37.08,52.83 AC2.C | 37.85,53.59 36.32,55.12 AC1.A 36.07,55.37 33.78,55.37 | 33.78,55.37 AB1.A | 42.42,51.31 42.42,50.55 AE2.C 42.42,50.29 44.96,50.29 | 42.42,51.31 43.43,52.32 AF1.A | 44.96,50.29 45.47,50.8 AG1.A | 44.96,50.29 44.7,50.04 44.7,49.02 AF2.C 44.7,48.77 46.23,47.24 | 46.99,48.01 46.99,48.77 47.5,49.28 AH1.A | 46.99,48.01 46.99,47.5 | 46.99,47.5 46.99,46.99 AG2.C | v49.28,46.23 49.02,45.97 49.02,44.96 AH2.C | 46.99,47.5 v48.01,47.5 | 46.23,47.24 46.99,48.01 | 46.23,47.24 40.39,41.4 39.12,41.4 R1.2 | 42.42,51.31 40.64,53.09
  Bottom 0.203: v48.01,47.5 v49.28,46.23
XB  (via drill 0.51)
  Top 0.203: 54.1,35.05 55.12,36.07 BF1.A 55.12,36.32 53.59,37.85 | 54.1,35.05 53.34,34.29 BD2.C | 54.1,35.05 55.37,33.78 55.63,33.78 BG1.A | 52.58,39.88 51.82,39.88 BB2.C | 52.58,39.88 v52.83,40.13 53.59,40.89 BD1.A | 54.1,38.35 54.36,38.61 BE1.A | 54.1,38.35 53.59,37.85 | 53.59,37.85 52.83,37.08 BC2.C | 52.58,39.88 54.1,38.35 | 30.48,48.26 30.48,50.04 BE2.C | 30.48,45.21 30.48,46.23 BG2.C 30.48,46.48 30.48,48.26 | 30.48,44.45 30.48,45.21 | 30.48,44.45 30.23,44.2 31.75,42.67 BH1.A | 30.48,44.45 BH2.C | 30.48,48.26 BF2.C | 51.05,42.42 51.31,42.42 v51.56,42.67 52.32,43.43 BC1.A | 51.05,42.42 50.55,42.42 BA2.C | 51.05,42.42 51.05,45.47 BB1.A 50.8,45.72 51.05,45.97 49.53,47.5 BA1.A 49.28,47.5 39.88,38.1 39.12,38.1 | 30.48,45.21 v33.02,45.21 | v39.12,39.88 39.12,38.1 | 39.12,38.1 R2.2
  Bottom 0.203: v33.02,45.21 33.78,45.21 v39.12,39.88 | v52.83,40.13 52.83,41.4 v51.56,42.67
XC  (via drill 0.51)
  Top 0.203: CA1.A 55.63,31.24 53.59,31.24 CA2.C 53.59,30.99 53.59,28.45 | 55.12,28.45 55.63,28.45 CB1.A | 55.12,28.45 53.59,28.45 | 53.59,28.45 53.34,28.45 CB2.C 53.59,28.45 | 53.59,22.61 53.59,21.34 CE1.A 53.59,21.08 53.59,20.07 52.32,18.8 CF1.A 52.32,18.54 | 53.59,22.61 54.36,23.37 CD1.A 54.36,23.62 53.59,24.38 | 53.59,22.61 51.82,22.61 CD2.C | 53.59,24.38 52.83,25.15 CC2.C | 53.59,24.38 55.12,25.91 CC1.A 55.12,26.16 55.12,28.45 | 50.55,16 51.05,16.51 CG1.A 51.05,16.76 52.32,18.03 52.32,18.54 | 50.55,16 49.53,14.99 49.53,14.73 CH1.A | 52.32,18.54 52.07,18.29 50.55,19.81 CE2.C | CH2.C 44.96,13.46 46.74,15.24 CG2.C 46.99,15.49 v47.75,16.26 48.77,17.27 48.77,17.53 CF2.C 49.02,17.53 50.55,16 | v41.4,22.61 39.88,21.08 39.62,21.08 R3.2
  Bottom 0.203: v47.75,16.26 v41.4,22.61
XD  (via drill 0.51)
  Top 0.203: 45.21,30.48 46.23,30.48 DG2.C 46.48,30.48 48.26,30.48 | 45.21,30.48 44.45,30.48 | 48.26,30.48 50.04,30.48 DE2.C | 48.26,30.48 DF2.C | 44.45,30.48 44.2,30.23 42.67,31.75 DH1.A | 44.45,30.48 DH2.C | 39.62,24.13 39.62,24.89 45.21,30.48 | 43.69,9.91 44.2,9.91 45.47,11.18 DB1.A 45.72,11.18 47.24,12.7 47.5,12.7 DA1.A 47.75,12.95 48.51,13.72 48.51,14.73 49.02,15.24 v49.02,16.26 | 43.69,9.91 43.94,10.16 42.42,11.68 DA2.C | 43.69,9.91 DC1.A 43.43,9.65 42.16,9.65 41.15,8.64 DD1.A 40.89,8.38 39.62,8.38 | 33.78,7.11 33.78,8.89 DD2.C | 33.78,7.11 33.78,6.6 DG1.A | 33.78,7.11 36.07,7.11 DF1.A 36.32,7.11 37.85,8.64 | 37.85,8.64 37.08,9.4 DC2.C | 37.85,8.64 38.61,7.87 DE1.A 38.86,7.87 39.37,8.38 39.62,8.38 | 39.62,8.38 39.62,10.41 DB2.C | v41.15,24.13 39.62,24.13 | 39.62,24.13 R4.2
  Bottom 0.203: v49.02,16.26 v41.15,24.13
XE  (via drill 0.51)
  Top 0.203: 18.8,10.41 18.8,10.67 19.81,11.68 EE2.C 20.07,11.68 21.84,9.91 | 18.8,10.41 18.8,9.91 EF1.A | 21.84,9.91 22.35,10.41 ED2.C 22.61,10.41 24.38,8.64 | 21.84,9.91 21.34,9.4 21.34,8.64 EE1.A | 24.38,8.64 25.15,9.4 EC2.C | 24.38,8.64 23.62,7.87 ED1.A | 30.99,6.6 EA2.C | 27.18,7.87 28.19,8.89 EB2.C | 27.18,7.87 26.42,7.11 26.16,7.11 EC1.A 25.91,7.11 24.38,8.64 | 27.18,7.87 28.45,6.6 EB1.A 28.7,6.6 30.99,6.6 | 30.99,6.6 EA1.A | EH1.A 14.73,12.95 14.73,14.73 EG2.C | EH2.C 13.46,17.27 15.24,15.49 EG2.C | 16.76,11.43 16.76,12.45 17.53,13.21 EF2.C | 16.76,11.43 16.76,11.18 EG1.A 16.76,11.43 | 17.78,12.45 16.76,11.43 | 21.84,16.51 17.78,12.45 | 21.84,16.51 24.13,18.8 24.13,20.83 R5.2 | 21.84,16.51 19.3,16.51 19.05,16.26 17.27,16.26 16.51,15.49 15.49,15.49 EG2.C | 18.8,10.41 19.3,10.41 v19.56,10.67 | 17.78,12.45 v18.03,12.19
  Bottom 0.203: v18.03,12.19 v19.56,10.67
XF  (via drill 0.51)
  Top 0.203: 32,13.97 32,12.19 FE2.C | 32,14.99 32,13.97 | 32,14.99 32,15.75 FG2.C | 32,13.97 FF2.C | 31.75,17.78 32,18.03 30.48,19.56 FH1.A 30.23,19.81 30.48,20.07 v29.72,20.83 | v26.16,24.38 25.91,24.13 R6.2 24.13,24.13 22.1,22.1 20.32,22.1 v15.75,17.53 | 32,14.99 29.72,14.99 28.96,15.75 29.97,16.76 30.73,16.76 31.75,17.78 | 31.75,17.78 FH2.C | FD1.A 8.64,21.34 9.4,21.34 10.41,22.35 FB2.C | 6.86,28.45 8.89,28.45 FD2.C | 8.64,24.38 9.4,25.15 FC2.C | 8.38,24.13 8.64,24.38 | 8.38,24.13 7.87,23.62 FE1.A | 8.64,24.38 7.11,25.91 FF1.A 6.86,26.16 6.86,28.45 | 6.86,28.45 FG1.A | 8.38,24.13 8.38,21.34 FD1.A | 11.68,20.07 10.41,18.8 9.91,18.8 FC1.A 9.65,18.54 9.65,18.03 v8.38,16.76 | 10.92,14.73 10.92,13.97 10.67,13.72 10.67,13.46 11.68,12.45 12.7,13.46 12.7,14.48 FA1.A | 10.92,14.73 10.92,16.51 FB1.A | 10.92,14.73 v10.67,14.73 6.86,10.92 3.3,14.48 3.3,14.99 8.38,20.07 8.38,21.08 FD1.A | 11.68,20.07 v10.41,20.07 | 11.68,20.07 FA2.C
  Bottom 0.203: v26.16,24.38 v29.72,20.83 | v8.38,16.76 8.64,16.76 v10.67,14.73 | v15.75,17.53 11.18,17.53 10.41,18.29 v10.41,20.07
XG  (via drill 0.51)
  Top 0.203: 7.62,31.24 8.64,31.24 GA2.C | 7.62,31.24 6.6,31.24 GA1.A | 7.62,33.78 8.89,33.78 GB2.C 8.89,34.04 8.89,36.32 | 7.62,33.78 6.6,33.78 GB1.A | 7.62,31.24 7.62,33.78 | 8.89,36.32 7.11,36.32 GC1.A | 8.89,36.32 9.4,36.83 GC2.C 9.4,37.08 7.87,38.61 GD1.A 7.87,38.86 8.64,39.62 | 8.64,39.62 8.64,40.89 GE1.A | 8.64,39.62 10.41,39.62 GD2.C 10.67,39.88 10.67,41.15 11.68,42.16 GE2.C 11.68,42.42 9.91,44.2 | 9.91,44.2 9.91,44.45 10.92,45.47 GG1.A 11.18,45.72 12.95,47.5 | 9.91,44.2 9.91,43.69 GF1.A | 14.48,45.97 15.24,46.74 GG2.C 15.49,46.99 v16.51,48.01 17.27,48.77 17.53,48.77 GH2.C | 14.48,45.97 13.46,44.96 GF2.C | 12.95,47.5 14.48,45.97 | v25.4,39.12 24.38,38.1 R7.2 | 12.95,47.5 GH1.A
  Bottom 0.203: v16.51,48.01 v25.4,39.12
XH  (via drill 0.51)
  Top 0.203: 18.29,52.07 19.81,50.55 HA2.C 20.07,50.55 21.34,50.55 | 18.29,52.07 18.54,52.32 HC1.A | HA1.A 14.73,49.53 14.99,49.53 16.51,51.05 HB1.A 16.76,51.31 17.53,52.07 18.29,52.07 | 28.45,55.12 28.45,55.63 HG1.A | 28.45,55.12 28.45,53.34 HD2.C | 22.61,53.85 22.86,53.85 23.37,54.36 HE1.A 23.62,54.36 24.38,53.59 | 22.61,53.85 21.34,53.85 HD1.A | 22.61,53.85 22.61,51.82 HB2.C 22.35,51.56 21.34,50.55 | 24.38,53.59 25.15,52.83 HC2.C | 24.38,53.59 25.91,55.12 HF1.A 26.16,55.12 28.45,55.12 | HE2.C 12.19,31.75 13.72,31.75 HF2.C 13.97,31.75 15.75,31.75 HG2.C 16,31.75 17.53,31.75 HH2.C | 18.03,32 19.56,30.48 HH1.A | 18.03,32 17.78,31.75 HH2.C | 18.03,32 21.59,35.56 21.59,38.61 24.13,41.15 R8.2 24.38,41.4 25.4,42.42 v25.4,46.23 | HH2.C 18.03,32 | v21.34,50.29 21.34,50.55
  Bottom 0.203: v25.4,46.23 v21.34,50.29
YA  (via drill 0.51)
  Top 0.203: v43.43,12.95 41.66,12.95 DA2.A | v47.24,11.43 48.26,11.43 48.51,11.68 DA1.C | v32.26,22.61 32.51,22.86 32.51,25.15 IC1.19 | v6.35,32.26 5.33,31.24 5.08,31.24 GA1.C | v8.64,29.97 9.14,29.97 10.16,30.99 GA2.A | EA2.A 32,9.14 32,6.1 31.24,5.33 31.24,5.08 EA1.C 30.99,4.83 29.46,4.83 28.96,4.32 v24.38,4.32 | 12.19,16.51 11.68,16 11.68,13.72 FA1.C | 12.19,16.51 12.19,18.03 12.45,18.29 12.45,19.3 12.7,19.56 12.7,20.32 12.95,20.57 FA2.A 13.21,20.83 14.99,22.61 v14.99,23.11 22.61,30.73 v23.11,30.73 | 12.19,16.51 v12.45,16.26 | 14.22,50.55 14.73,50.55 v14.99,50.8 | 14.22,50.55 13.72,50.55 HA1.C | 20.07,48.77 v19.05,49.78 | 20.07,48.77 20.57,49.28 HA2.A | AA1.C 30.99,57.15 29.46,55.63 29.46,55.12 28.96,54.61 28.96,54.1 30.99,52.07 AA2.A 31.24,52.07 32.26,52.07 v32.77,52.58 | v53.34,32.26 52.32,31.24 52.07,31.24 CA2.A | v56.13,29.97 57.15,30.99 CA1.C 57.4,31.24 57.91,31.75 v57.91,35.05 | v47.75,38.86 49.02,40.13 49.02,41.4 BA2.A | v51.82,49.02 51.56,48.77 50.55,48.77 BA1.C | 14.22,50.55 14.22,52.07 v21.84,59.69 | v17.02,41.91 17.02,43.43 18.29,44.7 18.29,46.23 19.56,47.5 19.56,48.26 20.07,48.77
  Bottom 0.203: v43.43,12.95 45.72,12.95 v47.24,11.43 47.75,10.92 45.47,8.64 44.96,8.64 44.2,9.4 44.2,9.65 33.02,20.83 33.02,21.34 32.26,22.1 v32.26,22.61 31.24,22.61 v23.11,30.73 23.11,35.81 v17.02,41.91 | v6.35,32.26 v8.64,29.97 8.64,29.46 v14.99,23.11 | v12.45,16.26 v24.38,4.32 | v14.99,50.8 18.03,50.8 v19.05,49.78 | 53.85,32.26 v53.34,32.26 | 53.85,32.26 v56.13,29.97 | 53.85,32.26 47.75,38.35 v47.75,38.86 34.04,52.58 v32.77,52.58 27.69,57.66 25.91,57.66 23.88,59.69 v21.84,59.69 | v51.82,49.02 52.83,48.01 52.83,46.23 55.88,43.18 55.88,37.08 v57.91,35.05
YB  (via drill 0.51)
  Top 0.203: v6.6,35.05 5.59,34.04 5.33,34.04 GB1.C | v9.4,32.77 10.41,33.78 GB2.A 10.67,34.04 10.67,34.54 v12.95,36.83 | 16.51,53.59 17.53,54.61 18.03,54.61 19.81,56.39 20.32,56.39 23.37,59.44 31.24,59.44 32.26,60.45 34.04,60.45 35.81,58.67 | 16.51,53.59 15.75,52.83 15.75,52.32 HB1.C | 35.81,58.67 34.04,56.9 AB1.C | v51.82,47.75 52.07,47.5 52.07,46.74 BB1.C | 35.81,58.67 v40.39,58.67 | v21.84,48.51 23.11,49.78 23.11,50.29 HB2.A | v16.76,53.34 16.51,53.59 | v24.13,46.23 28.96,51.05 31.5,51.05 32,51.56 33.78,51.56 AB2.A | FB1.C 9.91,15.49 9.65,15.49 6.6,12.45 6.1,12.45 3.81,14.73 10.92,21.84 11.18,21.84 11.43,22.1 11.43,22.86 11.68,23.11 FB2.A 11.94,23.37 11.94,23.62 v17.53,29.21 | v27.18,6.35 28.19,5.33 EB1.C | v26.92,8.89 26.92,9.14 28.19,10.41 EB2.A 28.45,10.67 30.23,10.67 30.48,10.92 32,10.92 v36.83,15.75 | v40.89,11.68 39.12,11.68 DB2.A | v44.96,7.62 44.96,7.87 46.23,9.14 46.23,9.65 46.48,9.91 DB1.C | v38.1,14.48 51.56,27.94 51.56,28.19 CB2.A 51.82,28.45 52.07,28.7 v52.07,29.72 | v48.26,36.58 50.29,38.61 50.29,38.86 BB2.A | v56.13,27.18 56.9,27.94 56.9,28.19 CB1.C | v32,21.08 33.27,22.35 33.27,25.15 IC1.20
  Bottom 0.203: v9.4,32.77 7.11,35.05 v6.6,35.05 6.6,36.07 5.08,37.59 5.08,43.18 16,54.1 v16.76,53.34 21.59,48.51 v21.84,48.51 v24.13,46.23 | v51.82,47.75 51.31,47.75 v40.39,58.67 | v27.18,6.35 27.18,8.64 v26.92,8.89 | v44.96,7.62 v40.89,11.68 v38.1,14.48 v36.83,15.75 32,20.57 v32,21.08 23.88,29.21 v17.53,29.21 12.95,33.78 v12.95,36.83 | v48.26,36.58 48.26,35.56 50.55,33.27 50.55,31.24 v52.07,29.72 54.61,27.18 v56.13,27.18
YC  (via drill 0.51)
  Top 0.203: v24.13,51.31 25.65,51.31 HC2.A | HC1.C 18.29,53.59 v19.56,53.59 19.56,55.37 20.07,55.88 20.57,55.88 23.62,58.93 32,58.93 v32.51,59.44 | v38.1,52.58 36.83,51.31 36.58,51.31 AC2.A | v37.59,55.63 36.58,56.64 AC1.C | v51.05,38.1 51.05,36.58 BC2.A | v52.07,44.96 52.58,45.47 53.59,44.45 BC1.C | v58.67,31.24 57.91,30.48 57.91,27.69 56.9,26.67 56.9,25.91 CC1.C 56.64,25.65 56.13,25.65 v55.12,24.64 | 41.4,17.02 48.77,24.38 49.78,24.38 51.05,25.65 CC2.A 51.31,25.91 51.82,26.42 v53.34,26.42 | 41.4,17.02 39.12,14.73 39.12,14.22 36.58,11.68 36.58,11.18 DC2.A | v34.54,23.62 34.54,25.15 IC1.21 | v41.66,16.76 41.4,17.02 | v5.84,15.49 8.38,18.03 FC1.C | v9.4,23.88 11.18,25.65 FC2.A | v22.35,3.3 22.35,3.56 24.13,5.33 25.65,5.33 EC1.C | v26.67,10.16 25.91,10.92 EC2.A | v38.35,2.54 43.94,8.13 43.94,8.38 DC1.C 44.2,8.64 v45.21,9.65 | v1.78,32 5.33,35.56 5.33,36.32 GC1.C 5.59,36.58 6.35,37.34 v7.37,37.34 | v9.91,35.56 10.67,36.32 10.92,36.32 GC2.A
  Bottom 0.203: v24.13,51.31 21.84,51.31 v19.56,53.59 | v51.05,38.1 51.05,39.62 48.77,41.91 | 48.77,41.91 v38.1,52.58 38.1,55.12 v37.59,55.63 35.56,57.66 34.29,57.66 v32.51,59.44 | 49.28,42.16 49.02,41.91 48.77,41.91 | 49.28,42.16 v52.07,44.96 | v58.67,31.24 58.67,33.02 49.53,42.16 49.28,42.16 | v34.54,23.62 34.8,23.62 v41.66,16.76 41.66,13.21 v45.21,9.65 | 8.13,25.15 4.32,21.34 4.32,20.83 4.83,20.32 4.83,17.02 5.84,16 v5.84,15.49 18.03,3.3 v22.35,3.3 23.88,1.78 26.16,4.06 | 8.13,25.15 v9.4,23.88 | v26.67,10.16 25.15,8.64 25.15,7.87 25.65,7.37 25.65,5.08 26.16,4.57 26.16,4.06 | v38.35,2.54 27.69,2.54 26.16,4.06 | v1.78,32 1.78,31.5 8.13,25.15 | v9.91,35.56 9.14,35.56 v7.37,37.34 | v53.34,26.42 v55.12,24.64
YD  (via drill 0.51)
  Top 0.203: v40.89,51.56 39.88,50.55 39.12,50.55 AD2.A | v40.13,55.12 39.37,55.88 AD1.C | v54.86,42.93 54.86,41.91 BD1.C | 21.84,56.13 24.13,58.42 34.29,58.42 v34.54,58.67 | 21.84,56.13 20.83,55.12 20.57,55.12 HD1.C | 14.22,37.59 14.22,36.83 11.18,33.78 11.18,33.27 10.92,33.02 10.92,30.48 10.67,30.23 10.67,28.45 FD2.A | 14.22,37.59 12.45,39.37 11.94,38.86 GD2.A 11.68,38.86 11.43,38.61 v9.91,38.61 | v7.62,40.13 6.86,39.37 6.35,39.37 GD1.C | 14.22,37.59 v27.18,50.55 28.19,51.56 HD2.A | v24.64,7.11 23.88,6.35 23.11,6.35 ED1.C 22.86,6.1 v21.34,6.1 | v24.13,10.92 23.37,11.68 ED2.A 23.37,11.94 23.37,12.7 v28.19,17.53 | v6.35,19.56 7.11,20.32 FD1.C | 42.42,21.34 v46.74,25.65 51.05,29.97 51.05,33.27 51.56,33.78 BD2.A | 42.42,21.34 42.16,21.08 42.16,19.81 34.04,11.68 34.04,10.67 DD2.A 34.04,10.41 v35.05,10.41 | v40.13,7.11 41.66,7.11 DD1.C | v49.02,23.37 50.29,23.37 CD2.A 50.55,23.37 50.8,23.62 v52.32,23.62 | v54.61,21.84 55.63,22.86 55.88,22.86 CD1.C | v36.83,25.91 36.32,25.4 35.31,25.4 IC1.22 | 42.42,21.34 v41.4,21.34 | v21.84,55.88 21.84,56.13
  Bottom 0.203: v54.86,42.93 54.86,43.43 46.99,51.31 41.15,51.31 v40.89,51.56 40.89,54.36 v40.13,55.12 36.58,58.67 v34.54,58.67 | v7.62,40.13 8.38,40.13 v9.91,38.61 9.91,36.83 10.92,35.81 10.92,33.78 17.02,27.69 18.29,27.69 28.19,17.78 v28.19,17.53 28.19,17.27 v35.05,10.41 38.35,7.11 v40.13,7.11 | v24.64,7.11 24.64,10.41 v24.13,10.92 | v6.35,19.56 7.87,19.56 v21.34,6.1 | v46.74,25.65 v49.02,23.37 | v54.61,21.84 54.1,21.84 v52.32,23.62 | v41.4,21.34 v36.83,25.91 | v27.18,50.55 v21.84,55.88
YE  (via drill 0.51)
  Top 0.203: v54.1,19.3 54.86,20.07 54.86,20.32 CE1.C | v51.31,20.83 49.28,20.83 CE2.A 49.02,20.83 v46.99,20.83 | v49.53,33.02 49.28,32.77 50.04,32 DE2.A | v38.61,27.69 38.1,27.18 37.08,27.18 IC1.23 | 35.05,49.28 32.77,49.28 32,50.04 BE2.A | 35.05,49.28 41.4,49.28 AE2.A | v22.1,7.87 21.59,7.37 20.57,7.37 EE1.C | v21.34,11.94 20.57,12.7 20.83,12.95 EE2.A 20.83,13.21 23.11,15.49 v24.89,15.49 | v5.33,21.08 6.1,21.84 6.1,22.86 FE1.C | v9.14,26.42 9.4,26.42 10.67,27.69 11.18,27.69 11.94,28.45 11.94,30.23 HE2.A | v2.79,41.66 3.81,40.64 4.32,40.64 5.33,41.66 7.11,41.66 GE1.C 7.37,41.91 7.62,42.16 v9.14,42.16 | v11.68,40.89 12.19,41.4 12.95,41.4 GE2.A | v24.38,57.4 23.11,56.13 HE1.C | v28.96,11.94 30.23,11.94 FE2.A | v36.83,4.32 38.61,6.1 39.12,6.1 DE1.C | v35.05,56.64 36.58,58.17 38.61,58.17 41.66,55.12 AE1.C | v55.88,46.23 55.88,39.37 BE1.C | v35.05,54.36 35.05,49.28
  Bottom 0.203: v51.31,20.83 52.83,19.3 v54.1,19.3 54.1,16.26 55.37,14.99 57.15,16.76 57.15,17.53 56.13,18.54 56.13,22.35 49.53,28.96 v49.53,33.02 49.53,33.27 33.53,49.28 32.77,49.28 24.64,57.4 v24.38,57.4 22.86,57.4 19.56,60.71 | v38.61,27.69 40.13,27.69 v46.99,20.83 | v21.34,11.94 22.1,11.18 v22.1,7.87 25.65,4.32 24.64,3.3 24.13,3.3 23.11,4.32 21.34,4.32 12.45,13.21 9.4,13.21 5.33,17.27 v5.33,21.08 7.11,22.86 7.62,22.86 8.64,21.84 10.41,23.62 10.41,24.13 9.14,25.4 9.14,25.65 | 9.14,25.65 v9.14,26.42 | 9.14,25.65 2.79,32 v2.79,41.66 1.27,43.18 18.8,60.71 19.56,60.71 | v11.68,40.89 10.41,40.89 v9.14,42.16 | v24.89,15.49 28.45,11.94 v28.96,11.94 35.05,5.84 35.56,5.84 36.83,4.57 v36.83,4.32 | 29.97,58.17 30.48,57.66 30.99,57.66 32,56.64 v35.05,56.64 v35.05,54.36 | 29.97,58.17 26.16,58.17 24.13,60.2 22.61,60.2 22.1,60.71 19.56,60.71 | v55.88,46.23 52.07,50.04 50.29,50.04 40.64,59.69 33.53,59.69 32.77,60.45 32.26,60.45 29.97,58.17
YF  (via drill 0.51)
  Top 0.203: v50.55,18.54 47.75,18.54 CF2.A | v52.58,17.02 53.59,18.03 CF1.C 53.85,18.29 54.36,18.29 55.63,19.56 55.63,20.07 55.88,20.32 55.88,21.59 56.9,22.61 56.9,24.38 57.4,24.89 57.4,25.4 57.66,25.65 57.66,26.67 58.42,27.43 58.42,29.46 59.69,30.73 59.69,39.37 | v39.88,28.96 38.61,28.96 37.59,27.94 37.08,27.94 IC1.24 | BF2.A v33.02,48.26 39.12,48.26 40.39,46.99 40.89,47.5 43.69,47.5 AF2.A | v24.64,56.13 25.15,56.64 25.65,56.64 HF1.C | 48.51,33.27 49.28,34.04 50.55,34.04 51.05,34.54 51.56,34.54 51.82,34.8 52.58,34.8 v53.59,35.81 | 48.51,33.27 48.26,33.02 DF2.A | v55.37,35.05 56.64,36.32 BF1.C 56.9,36.58 59.69,39.37 | 59.69,39.37 61.72,41.4 61.72,41.91 50.04,53.59 44.2,53.59 AF1.C 43.94,53.85 43.94,56.39 38.61,61.72 20.83,61.72 1.27,42.16 1.27,32.77 0.76,32.26 0.76,31.75 2.54,29.97 | 48.51,33.27 v48.26,33.27 | v32.26,4.83 28.45,1.02 23.37,1.02 18.29,6.1 18.29,8.38 EF1.C | v35.31,4.83 35.81,4.83 36.32,5.33 DF1.C | v19.56,15.49 18.8,14.73 18.54,14.73 EF2.A | v27.43,11.68 29.72,13.97 FF2.A | v5.08,32.51 2.54,29.97 | 2.54,29.97 2.29,29.72 5.33,26.67 5.33,25.91 FF1.C | v12.95,28.96 13.72,29.72 13.72,30.23 HF2.A | v7.87,43.18 8.38,43.69 8.38,43.94 GF1.C | v11.68,43.69 14.48,43.69 GF2.A
  Bottom 0.203: v52.58,17.02 51.05,18.54 v50.55,18.54 40.13,28.96 v39.88,28.96 | v24.64,56.13 25.15,56.13 v33.02,48.26 33.27,48.26 v48.26,33.27 | v53.59,35.81 54.61,35.81 v55.37,35.05 | 34.29,4.83 v35.31,4.83 | v32.26,4.83 34.29,4.83 | 22.86,15.49 23.62,15.49 v27.43,11.68 34.29,4.83 | 22.86,15.49 v19.56,15.49 | v5.08,32.51 6.1,33.53 6.35,33.27 6.6,33.27 9.65,30.23 9.65,29.72 10.41,28.96 | 11.68,27.69 16,23.37 16,22.35 22.86,15.49 | 11.68,27.69 10.41,28.96 | 11.68,27.69 v12.95,28.96 | 10.41,28.96 10.41,33.02 5.59,37.85 5.59,40.89 v7.87,43.18 8.38,43.69 v11.68,43.69
YG  (via drill 0.51)
  Top 0.203: EG1.C 15.75,9.91 14.99,9.91 7.62,2.54 7.62,1.27 8.38,0.51 29.21,0.51 33.78,5.08 DG1.C 34.04,5.08 34.04,4.57 38.1,0.51 46.23,0.51 46.99,1.27 46.99,2.54 56.64,12.19 56.64,16.51 57.15,17.02 57.15,17.53 55.88,18.8 53.09,16 52.32,16 CG1.C 52.07,15.75 51.56,15.75 v51.05,15.24 | v41.15,20.07 37.85,16.76 31.5,16.76 30.73,16 30.48,16 FG2.A | v44.96,17.27 45.72,16.51 CG2.A | v35.31,27.94 36.07,28.7 36.83,28.7 IC1.25 | v14.99,45.21 15.49,45.72 16.26,45.72 GG2.A | v11.18,46.99 10.67,46.99 10.16,46.48 GG1.C 9.91,46.23 8.64,46.23 v4.06,41.66 | v6.35,29.72 5.33,28.7 5.33,28.45 FG1.C | v11.94,24.89 11.94,25.4 13.46,26.92 13.46,27.43 14.22,28.19 14.22,28.7 15.75,30.23 HG2.A | v17.78,18.29 16.51,17.02 16.51,16.51 EG2.A | DG2.A 46.48,32 46.48,36.32 v49.02,38.86 49.28,39.12 49.28,39.37 49.78,39.88 50.29,39.88 53.85,43.43 54.1,43.43 54.86,44.2 54.86,47.24 49.02,53.09 47.5,53.09 46.74,52.32 AG1.C | v44.96,44.45 45.72,45.21 45.72,45.72 AG2.A | v41.4,46.48 v33.02,46.48 32,46.48 BG2.A | v29.72,57.15 28.45,57.15 HG1.C | v55.88,32.51 56.9,33.53 56.9,33.78 BG1.C
  Bottom 0.203: v35.31,27.94 35.31,25.91 v41.15,20.07 42.16,20.07 v44.96,17.27 46.99,15.24 v51.05,15.24 51.05,13.72 53.34,11.43 53.85,11.43 61.72,19.3 61.72,26.67 v55.88,32.51 55.37,32.51 v49.02,38.86 44.96,42.93 v44.96,44.45 42.93,46.48 v41.4,46.48 30.73,57.15 v29.72,57.15 | v14.99,45.21 12.95,45.21 v11.18,46.99 | v17.78,18.29 17.78,19.81 16.76,20.83 16,20.83 v11.94,24.89 7.11,29.72 v6.35,29.72 4.06,32 v4.06,41.66 4.06,44.96 19.3,60.2 v33.02,46.48
YH  (via drill 0.51)
  Top 0.203: v45.21,14.99 44.96,14.73 43.94,14.73 CH2.A | v49.28,13.21 50.04,13.21 50.29,13.46 CH1.C | 41.66,29.46 42.42,30.23 DH1.C | 41.66,29.46 v36.07,23.88 32,19.81 FH1.C | 42.93,33.53 44.45,32 DH2.A | 42.93,33.53 41.66,32.26 41.66,32 | 41.66,32 41.66,29.46 | 47.5,43.18 47.5,39.88 46.74,39.12 46.74,37.34 42.93,33.53 | 47.5,43.18 47.5,43.69 AH2.A | v46.74,50.29 46.99,50.55 48.51,50.55 AH1.C | v48.77,43.18 47.5,43.18 | 41.66,32 39.37,29.72 37.08,29.72 IC1.26 | v17.53,15.24 15.75,13.46 15.75,12.7 14.73,11.68 13.72,11.68 EH1.C | v15.75,18.8 14.99,18.8 14.73,18.54 EH2.A | v24.89,12.95 29.72,17.78 FH2.A | v13.46,48.51 11.94,48.51 GH1.C | v17.27,44.96 17.27,46.48 18.29,47.5 GH2.A | 32.77,43.69 32.77,42.16 31.75,41.15 30.48,42.42 BH1.C 30.23,42.42 v24.64,36.83 19.81,32 HH1.C 19.81,31.75 20.32,31.24 20.32,29.72 19.3,28.7 | 32.77,43.69 32,44.45 BH2.A | 19.3,28.7 17.78,30.23 HH2.A | v12.7,22.1 19.3,28.7 | v44.96,47.24 44.7,47.24 44.2,46.74 43.69,46.74 41.91,44.96 36.83,44.96 36.32,44.45 33.53,44.45 32.77,43.69
  Bottom 0.203: v49.28,13.21 47.75,14.73 46.74,14.73 46.48,14.99 v45.21,14.99 44.96,14.99 v36.07,23.88 | 46.74,47.24 46.74,45.21 v48.77,43.18 | 46.74,47.24 v46.74,50.29 | v24.89,12.95 19.81,12.95 v17.53,15.24 17.53,17.02 v15.75,18.8 15.75,19.05 v12.7,22.1 | v13.46,48.51 13.72,48.51 v17.27,44.96 17.27,44.2 v24.64,36.83 | v44.96,47.24 46.74,47.24

### Text on the board
tPlace: 12 | 9 | 3 | VCC | TXD | RXD | GND | VCC | RST | MISO | MOSI | SCK | GND | 6
bPlace: LED Analog Clock Face | (c) 2010 Jeremy Cole | 2010-03-19